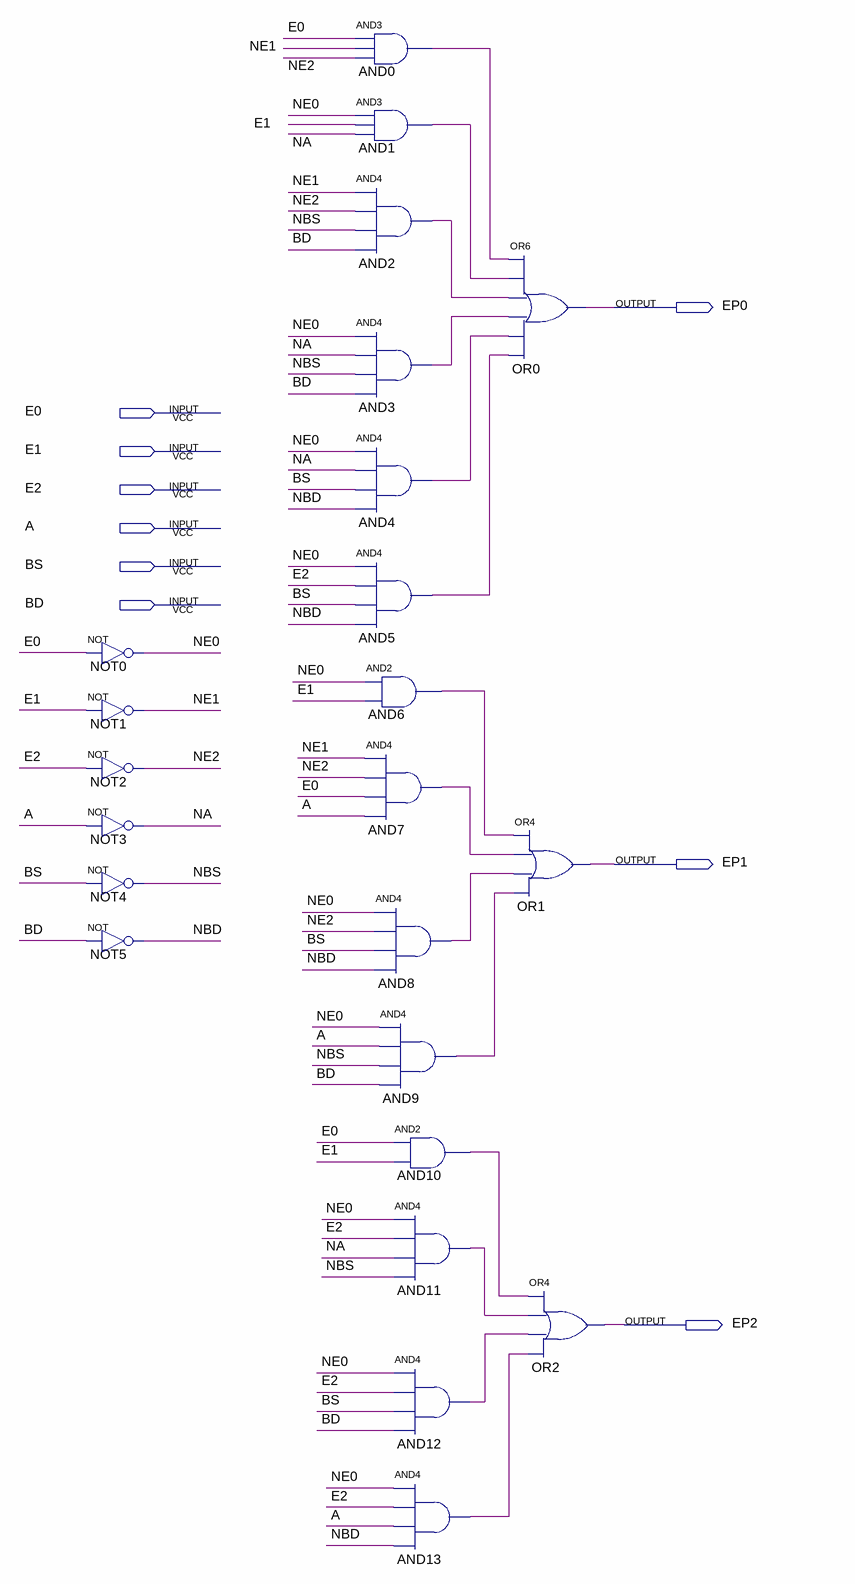
[diagram p0: schematic sheet]
// Quartus schematic LOG_ESTADO.bdf as structural Verilog: 23 symbols, 9 pins
module LOG_ESTADO (
  input  E0,
  input  E1,
  input  E2,
  input  A,
  input  BS,
  input  BD,
  output EP0,
  output EP1,
  output EP2
);

  wire AND0_out, AND1_out, AND2_out, AND3_out, AND4_out, AND5_out, AND6_out, AND7_out, AND8_out, AND9_out,
       AND10_out, AND11_out, AND12_out, AND13_out, NA, NBD, NBS, NE0, NE1, NE2;

  not NOT0 (NE0, E0);
  not NOT1 (NE1, E1);
  not NOT2 (NE2, E2);
  not NOT3 (NA, A);
  not NOT4 (NBS, BS);
  not NOT5 (NBD, BD);
  and AND0 (AND0_out, E0, NE1, NE2);
  and AND1 (AND1_out, NE0, E1, NA);
  and AND2 (AND2_out, NE1, NE2, NBS, BD);
  and AND3 (AND3_out, NE0, NA, NBS, BD);
  and AND4 (AND4_out, NE0, NA, BS, NBD);
  and AND5 (AND5_out, NE0, E2, BS, NBD);
  and AND6 (AND6_out, NE0, E1);
  and AND7 (AND7_out, NE1, NE2, E0, A);
  and AND8 (AND8_out, NE0, NE2, BS, NBD);
  and AND9 (AND9_out, NE0, A, NBS, BD);
  and AND10 (AND10_out, E0, E1);
  and AND11 (AND11_out, NE0, E2, NA, NBS);
  and AND12 (AND12_out, NE0, E2, BS, BD);
  and AND13 (AND13_out, NE0, E2, A, NBD);
  or OR0 (EP0, AND0_out, AND1_out, AND2_out, AND3_out, AND4_out, AND5_out);
  or OR1 (EP1, AND6_out, AND7_out, AND8_out, AND9_out);
  or OR2 (EP2, AND10_out, AND11_out, AND12_out, AND13_out);
endmodule
